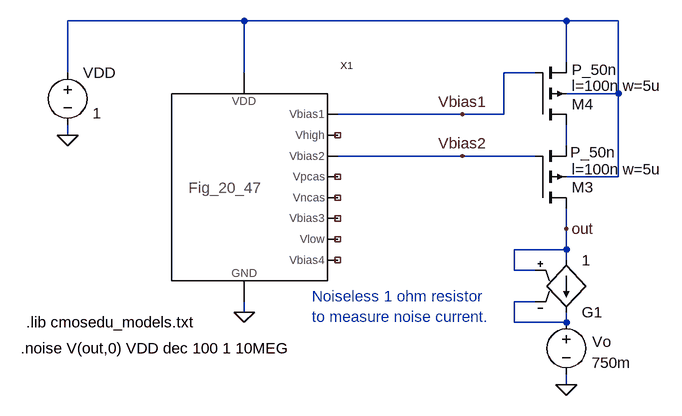
[diagram p0: schematic NOISE_PMOS_Cascode.asc]
NOISE_PMOS_Cascode.asc, the LTspice schematic file:
Version 4
SHEET 1 956 680
WIRE -528 -256 -800 -256
WIRE -32 -256 -528 -256
WIRE 48 -256 -32 -256
WIRE -32 -192 -32 -256
WIRE -800 -176 -800 -256
WIRE -528 -176 -528 -256
WIRE -80 -176 -128 -176
WIRE 48 -144 48 -256
WIRE 48 -144 -32 -144
WIRE -192 -112 -384 -112
WIRE -128 -112 -128 -176
WIRE -128 -112 -192 -112
WIRE -800 -80 -800 -96
WIRE -32 -64 -32 -96
WIRE -192 -48 -384 -48
WIRE -80 -48 -192 -48
WIRE 48 -16 48 -144
WIRE 48 -16 -32 -16
WIRE -32 64 -32 32
WIRE -32 96 -32 64
WIRE -32 96 -112 96
WIRE -32 112 -32 96
WIRE -112 128 -112 96
WIRE -80 128 -112 128
WIRE -80 176 -112 176
WIRE -528 192 -528 176
WIRE -112 208 -112 176
WIRE -32 208 -32 192
WIRE -32 208 -112 208
WIRE -32 304 -32 288
FLAG -800 -80 0
FLAG -528 192 0
FLAG -32 304 0
FLAG -32 64 out
FLAG -192 -112 Vbias1
FLAG -192 -48 Vbias2
SYMBOL pmos4 -80 -96 M180
WINDOW 123 56 60 Left 2
WINDOW 3 56 85 Left 2
SYMATTR Value2 l=100n w=5u
SYMATTR Value P_50n
SYMATTR InstName M4
SYMBOL Fig_20_47 -528 0 R0
SYMATTR InstName X1
SYMBOL voltage -800 -192 R0
WINDOW 123 0 0 Left 2
WINDOW 39 0 0 Left 2
WINDOW 3 39 78 Left 2
SYMATTR Value 1
SYMATTR InstName VDD
SYMBOL pmos4 -80 32 M180
WINDOW 123 56 60 Left 2
WINDOW 3 54 86 Left 2
SYMATTR Value2 l=100n w=5u
SYMATTR Value P_50n
SYMATTR InstName M3
SYMBOL g2 -32 208 M180
SYMATTR InstName G1
SYMATTR Value 1
SYMBOL voltage -32 192 R0
WINDOW 123 0 0 Left 2
WINDOW 39 0 0 Left 2
WINDOW 3 39 78 Left 2
WINDOW 0 40 46 Left 2
SYMATTR Value 750m
SYMATTR InstName Vo
TEXT -872 248 Left 2 !.noise V(out,0) VDD dec 100 1 10MEG
TEXT -864 208 Left 2 !.lib cmosedu_models.txt
TEXT -424 168 Left 2 ;Noiseless 1 ohm resistor\nto measure noise current.

The netlist it stands for:
* NOISE_PMOS_Cascode.asc
M4 N002 Vbias1 N001 N001 P_50n l=100n w=5u
XX1 Vbias1 NC_01 Vbias2 NC_02 NC_03 NC_04 NC_05 NC_06 N001 0 Fig_20_47  ; pins Vbias1 Vhigh Vbias2 Vpcas Vncas Vbias3 Vlow Vbias4 VDD GND
VDD N001 0 1
M3 out Vbias2 N002 N001 P_50n l=100n w=5u
G1 out N003 out N003 1
Vo N003 0 750m
.model NMOS NMOS
.model PMOS PMOS
.lib standard.mos
.noise V(out,0) VDD dec 100 1 10MEG
.lib cmosedu_models.txt
* Noiseless 1 ohm resistor
* to measure noise current.
.backanno
.end